# Altium schematic sheet 7SEG_Plate.SchDoc
size A4
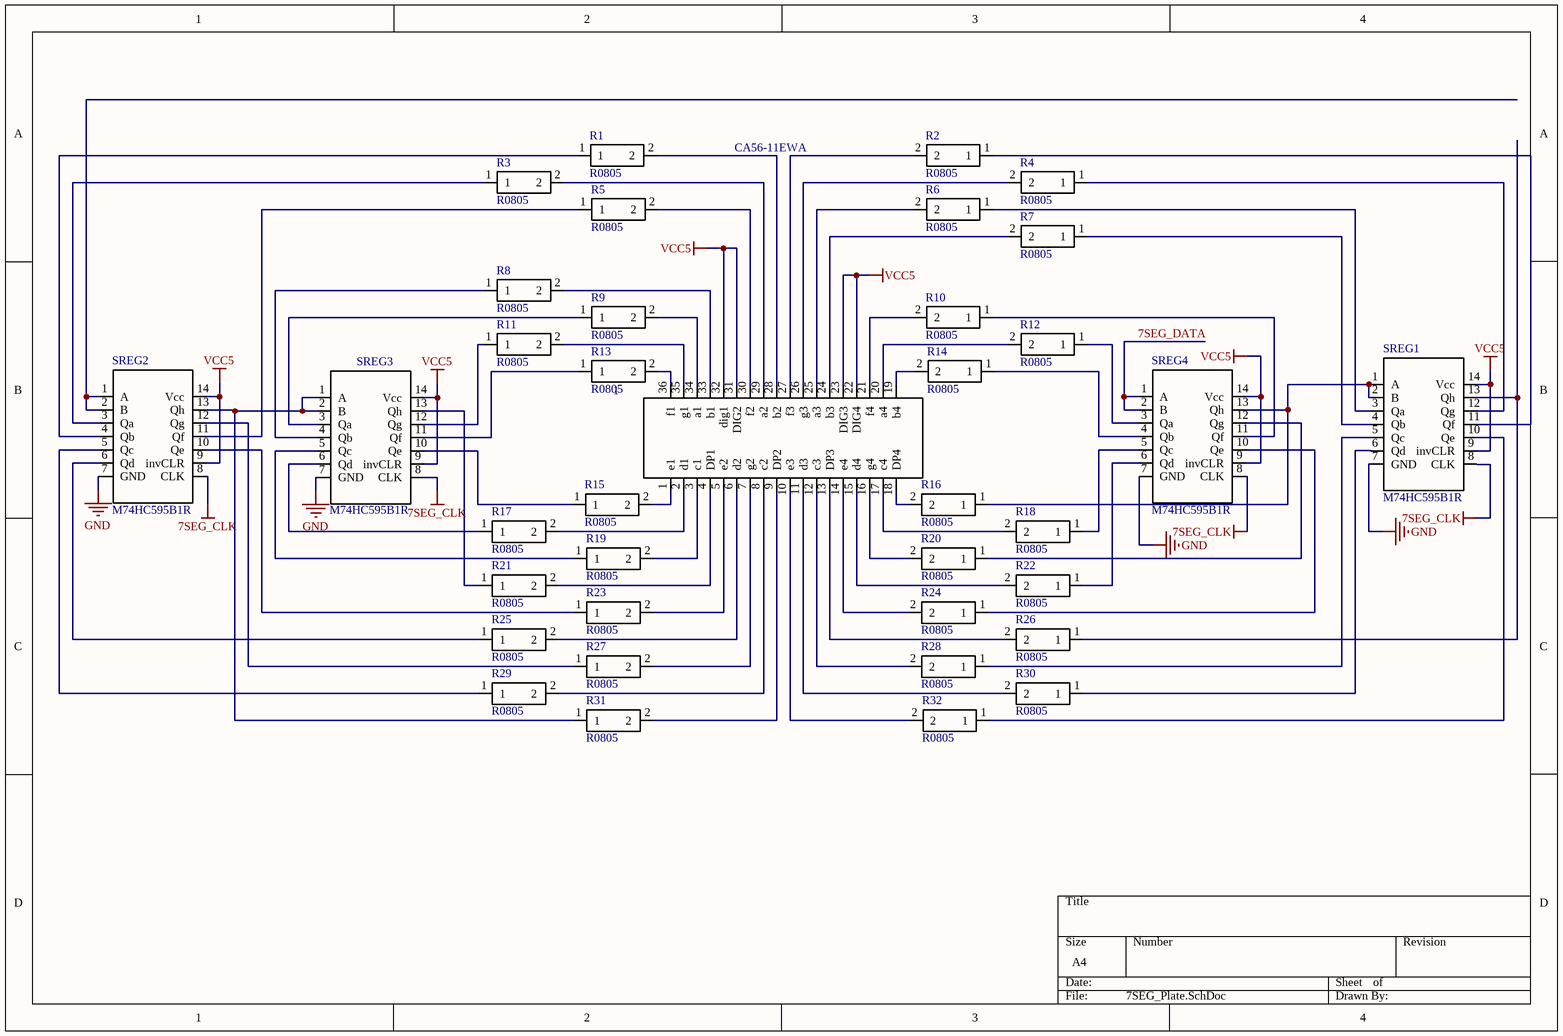
[diagram p0: 7SEG_Plate.SchDoc]

## Parts
1  CA56-11EWA  [CA56-11EWA]
R1  R0805  [R0805]
R2  R0805  [R0805]
R3  R0805  [R0805]
R4  R0805  [R0805]
R5  R0805  [R0805]
R6  R0805  [R0805]
R7  R0805  [R0805]
R8  R0805  [R0805]
R9  R0805  [R0805]
R10  R0805  [R0805]
R11  R0805  [R0805]
R12  R0805  [R0805]
R13  R0805  [R0805]
R14  R0805  [R0805]
R15  R0805  [R0805]
R16  R0805  [R0805]
R17  R0805  [R0805]
R18  R0805  [R0805]
R19  R0805  [R0805]
R20  R0805  [R0805]
R21  R0805  [R0805]
R22  R0805  [R0805]
R23  R0805  [R0805]
R24  R0805  [R0805]
R25  R0805  [R0805]
R26  R0805  [R0805]
R27  R0805  [R0805]
R28  R0805  [R0805]
R29  R0805  [R0805]
R30  R0805  [R0805]
R31  R0805  [R0805]
R32  R0805  [R0805]
SREG1  M74HC595B1R  [SN74HC164DR-D]
SREG2  M74HC595B1R  [SN74HC164DR-D]
SREG3  M74HC595B1R  [SN74HC164DR-D]
SREG4  M74HC595B1R  [SN74HC164DR-D]

## Nets
7SEG_CLK: SREG1.8(CLK) SREG2.8(CLK) SREG3.8(CLK) SREG4.8(CLK)
GND: SREG1.7(GND) SREG2.7(GND) SREG3.7(GND) SREG4.7(GND)
VCC5: 1.22(DIG4) 1.23(DIG3) 1.31(DIG2) 1.32(dig1) SREG1.9(invCLR) SREG1.14(Vcc) SREG2.9(invCLR) SREG2.14(Vcc) SREG3.9(invCLR) SREG3.14(Vcc) SREG4.9(invCLR) SREG4.14(Vcc)
7SEG_DATA: SREG4.1(A) SREG4.2(B)
Net1_1: 1.1(e1) R15.2
Net1_2: 1.2(d1) R17.2
Net1_3: 1.3(c1) R19.2
Net1_4: 1.4(DP1) R21.2
Net1_5: 1.5(e2) R23.2
Net1_6: 1.6(d2) R25.2
Net1_7: 1.7(g2) R27.2
Net1_8: 1.8(c2) R29.2
Net1_9: 1.9(DP2) R31.2
Net1_10: 1.10(e3) R32.2
Net1_11: 1.11(d3) R30.2
Net1_12: 1.12(c3) R28.2
Net1_13: 1.13(DP3) R26.2
Net1_14: 1.14(e4) R24.2
Net1_15: 1.15(d4) R22.2
Net1_16: 1.16(g4) R20.2
Net1_17: 1.17(c4) R18.2
Net1_18: 1.18(DP4) R16.2
Net1_19: 1.19(b4) R14.2
Net1_20: 1.20(a4) R12.2
Net1_21: 1.21(f4) R10.2
Net1_24: 1.24(b3) R7.2
Net1_25: 1.25(a3) R6.2
Net1_26: 1.26(g3) R4.2
Net1_27: 1.27(f3) R2.2
Net1_28: 1.28(b2) R1.2
Net1_29: 1.29(a2) R3.2
Net1_30: 1.30(f2) R5.2
Net1_33: 1.33(b1) R8.2
Net1_34: 1.34(a1) R9.2
Net1_35: 1.35(g1) R11.2
Net1_36: 1.36(f1) R13.2
NetR1_1: R1.1 SREG2.4(Qb)
NetR2_1: R2.1 SREG1.11(Qf)
NetR3_1: R3.1 SREG2.3(Qa)
NetR4_1: R4.1 SREG1.12(Qg)
NetR5_1: R5.1 SREG2.11(Qf)
NetR6_1: R6.1 SREG1.3(Qa)
NetR7_1: R7.1 SREG1.4(Qb)
NetR8_1: R8.1 SREG3.4(Qb)
NetR9_1: R9.1 SREG3.3(Qa)
NetR10_1: R10.1 SREG4.11(Qf)
NetR11_1: R11.1 SREG3.12(Qg)
NetR12_1: R12.1 SREG4.3(Qa)
NetR13_1: R13.1 SREG3.11(Qf)
NetR14_1: R14.1 SREG4.4(Qb)
NetR15_1: R15.1 SREG3.10(Qe)
NetR16_1: R16.1 SREG1.1(A) SREG1.2(B) SREG4.13(Qh)
NetR17_1: R17.1 SREG3.6(Qd)
NetR18_1: R18.1 SREG4.5(Qc)
NetR19_1: R19.1 SREG3.5(Qc)
NetR20_1: R20.1 SREG4.12(Qg)
NetR21_1: R21.1 SREG3.13(Qh)
NetR22_1: R22.1 SREG4.6(Qd)
NetR23_1: R23.1 SREG2.10(Qe)
NetR24_1: R24.1 SREG4.10(Qe)
NetR25_1: R25.1 SREG2.6(Qd)
NetR26_1: R26.1 SREG1.13(Qh)
NetR27_1: R27.1 SREG2.12(Qg)
NetR28_1: R28.1 SREG1.5(Qc)
NetR29_1: R29.1 SREG2.5(Qc)
NetR30_1: R30.1 SREG1.6(Qd)
NetR31_1: R31.1 SREG2.13(Qh) SREG3.1(A) SREG3.2(B)
NetR32_1: R32.1 SREG1.10(Qe)
NetSREG2_1: SREG2.1(A) SREG2.2(B)